# Altium schematic sheet power_on.SchDoc
size A4; SheetNumber: 2; SheetTotal: 2
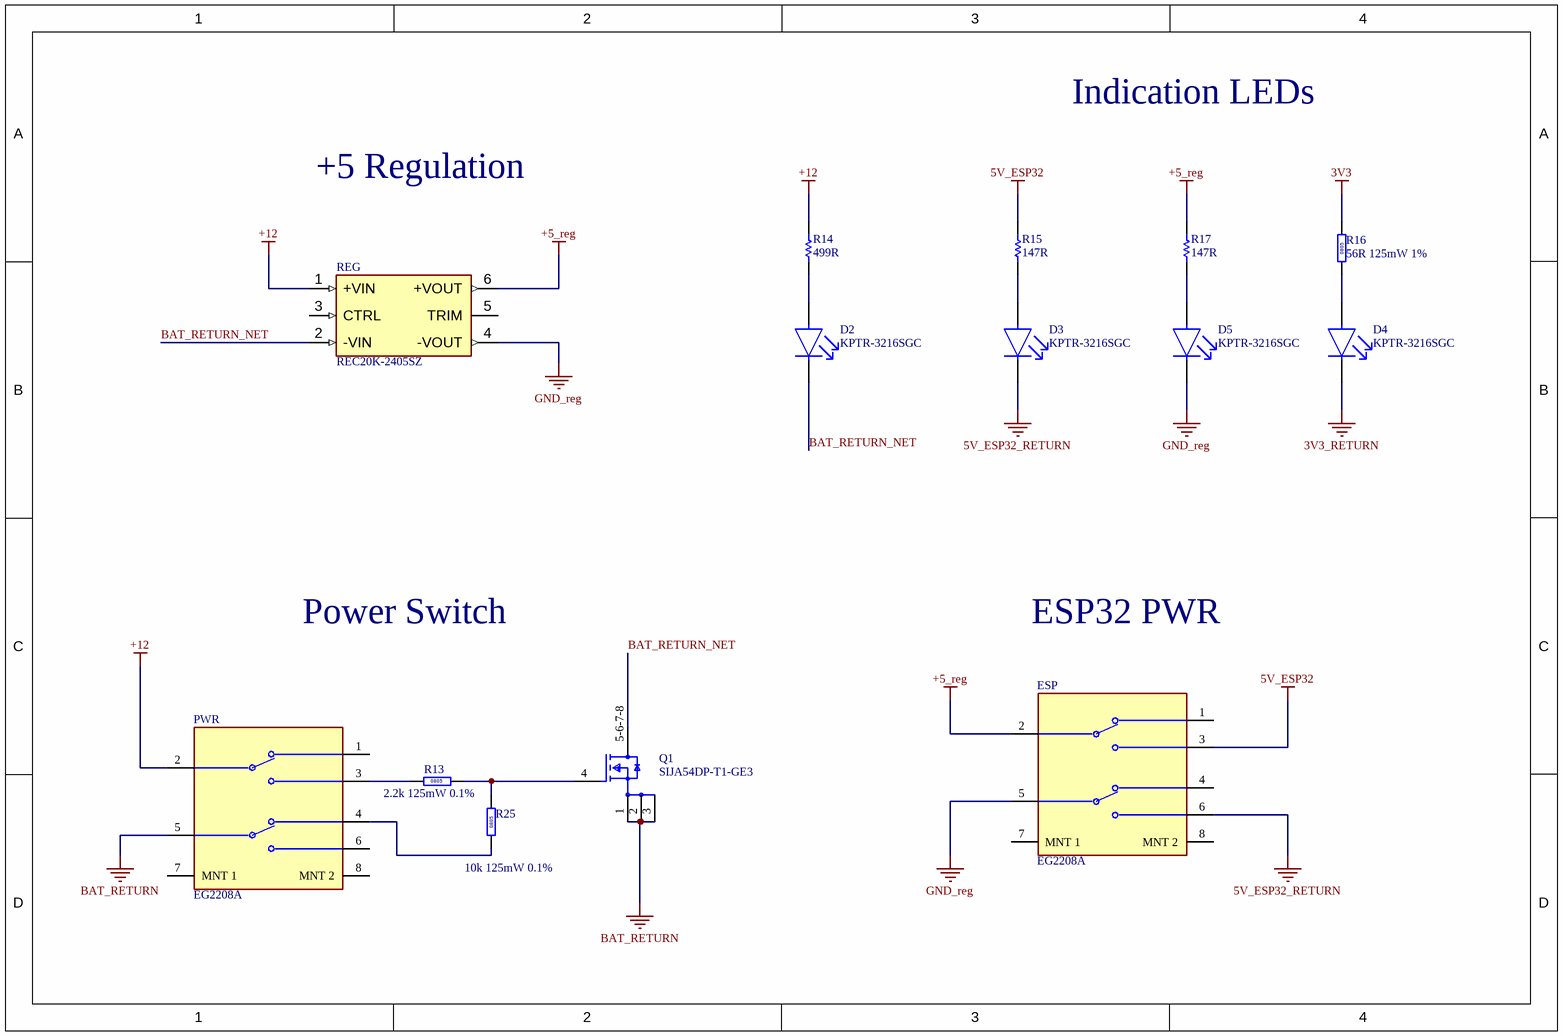
[diagram p0: power_on.SchDoc]

## Parts
D2  KPTR-3216SGC  [KPTR-3216SGC-Footprint-1]
D3  KPTR-3216SGC  [KPTR-3216SGC-Footprint-1]
D4  KPTR-3216SGC  [KPTR-3216SGC-Footprint-1]
D5  KPTR-3216SGC  [KPTR-3216SGC-Footprint-1]
ESP  EG2208A  [FP-EG2208A-MFG]
PWR  EG2208A  [FP-EG2208A-MFG]
Q1  SIJA54DP-T1-GE3  [SIJA54DP-T1-GE3-Footprint-2]
R13  2.2k 125mW 0.1%  [RESC2013X60X35ML10T20]
R14  499R  [RESC2013X60X40ML20T25]
R15  147R  [RESC2013X60X40ML20T25]
R16  56R 125mW 1%  [RESC2013X60X35ML10T20]
R17  147R  [RESC2013X60X40ML20T25]
R25  10k 125mW 0.1%  [RESC2013X60X35ML10T20]
REG  REC20K-2405SZ  [CONV_REC20K-2405SZ]

## Nets
3V3: R16.2
3V3_RETURN: D4.2(C)
5V_ESP32: ESP.3 R15.2
5V_ESP32_RETURN: D3.2(C) ESP.6
+5_reg: ESP.2(Com) R17.2 REG.6(+VOUT)
+12: PWR.2(Com) R14.2 REG.1(+VIN)
BAT_RETURN: PWR.5(Com) Q1.1(S) Q1.2(S) Q1.3(S)
GND_reg: D5.2(C) ESP.5(Com) REG.4(-VOUT)
BAT_RETURN_NET: D2.2(C) Q1.5-6-7-8(D) REG.2(-VIN)
NetD2_1: D2.1(A) R14.1
NetD3_1: D3.1(A) R15.1
NetD4_1: D4.1(A) R16.1
NetD5_1: D5.1(A) R17.1
NetPWR_3: PWR.3 R13.1
NetPWR_4: PWR.4 R25.1
NetQ1_4: Q1.4(G) R13.2 R25.2

Not connected (* = marked no-connect by the designer): ESP 1 4 7(MNT_1) 8(MNT_2); PWR 1 6 7(MNT_1) 8(MNT_2); REG 3(CTRL) 5(TRIM)

## Notes on the sheet
- Indication LEDs
- +5 Regulation
- Power Switch
- ESP32 PWR
- Sheet Title
- Design Title
- Sheet
- SIZE
- A4
- Designer
- PCB Code
- PCB Rev
- Approver
- Assembly Code
- Issue
- EC No.
- Approved Date

## Library data of the parts
D2-D5 = CMP-40-060-00012-7: Single Color LED, Super Bright Green, Water Clear, 1.6mm; Manufacturer: Kingbright; Reverse Voltage-Max: 5V; Overall Height: 1.05mm; Channels: 1; Luminous Intensity-Nom: 15mcd; Forward Voltage: 2.5V; Shape: Rectangular; Luminous Intensity-Min: 120cd; Viewing Angle: 120°; Forward Current: 25mA; ComponentLinkDescription: Datasheet; Terminal Pitch: 3.6mm; Size: 1.6mm; Colour: Super Bright Green; Min Operating Temperature: -40°C; Max Operating Temperature: 85°C; Package: 1206; ComponentLinkURL: https://datasheet.ciiva.com/pdfs/VipMasterIC/IC/KNGB/KNGBS03251/KNGBS03251-1.pdf?src-supplier=IHS+Markit; RoHS Compliant: Yes; Color@wavelength: Green; Maximum Operating Temperature: 85°C; Packaging: Tape and Reel; Minimum Operating Temperature: -40°C; ManufacturerPartNumber: KPTR-3216SGC; Pins: 2; Optoelectronic Device Type: SINGLE COLOR LED; Color: Green; MountingType: SMD; Reach SVHC Compliant: Yes; ForwardVoltage: 2.5V; Lens Style: WATER CLEAR; Mounting Technology: Surface Mount
ESP PWR = CMP-17877-000003-1: SWITCH SLIDE DPDT 200MA 30V; Switch Travel: 2mm; Actuator Type: Standard; Switch Function: On-On; Actuator Length: 6mm; Operating Force: 200gf; Illumination Type: Non-Illuminated; Electrical Life: 10000Cycles; Number of Positions: 2; Contact Current Rating: 200mA; Contact Material: Copper Alloy; Throw Configuration: DPDT; RoHS Compliant: Yes; Lead Free: Lead Free; Termination: PC Pin; Package Quantity: 800; Current Rating: 200mA; REACH SVHC: No SVHC; Max Operating Temperature: 70°C; Min Operating Temperature: -25°C; Contact Plating: Silver; Voltage Rating (DC): 30V; Voltage Rating (AC): 30V; Mount: Through Hole; Orientation: Right Angle; Packaging: Bulk; Series: EG
Q1 = CMP-40-040-00025-2: Transistor, SMD, MOSFET, N-Chan, 40V; Manufacturer: Vishay; ComponentLinkDescription: Datasheet; CurrentRating: 60A; PowerRating: 36.7W; Minimum Operating Temperature: -55°C; Package: PowerPak SO-8; Breakdown Voltage: 40V; RoHS3Compliant: Yes; Maximum Operating Temperature: 150°C; TransistorType: MOSFET, N-Chan; ComponentLinkURL: https://datasheet.ciiva.com/pdfs/VipMasterIC/IC/VISH/VISH-S-A0002290573/VISH-S-A0002281459-1.pdf?src-supplier=IHS+Markit; MountingType: SMD; ManufacturerPartNumber: SIJA54DP-T1-GE3
R13 R25 = CMP-40-025-00231-1: Res, SMD, 100k, 125mW, 0.1%, ±25ppm, 0805; Manufacturer: Panasonic; ManufacturerPartNumber: ERA-6AEB104V; Voltage Rating: 100V; ComponentLinkDescription: Datasheet; Package Height: 0.6; Power Rating: 125mW; Resistor Type: Fixed; RoHS3Certificate: https://download.siliconexpert.com/pdfs2/2024/6/2/9/59/48/925943/pns_/manual/erj6enf2700v_rohs.pdf; Mount: SMD; Case/Package: 0805; Composition: Thin Film; Temperature Coefficient (ppm/cel): ±25ppm; Min Operating Temperature: -55°C; ComponentLinkURL: https://octopart.com/era-6aeb104v-panasonic-1193246; Tolerance: 0.1%; Number of Pins: 2; Reach SVHC Compliant: Unaffected; RoHS3Compliant: Yes (with excemption); Contact Plating: Tin; Max Operating Temperature: 155°C; Resistance: 100k
R14 R15 R17 = CMP-2001-00837-1: Part Number: ERA6AEB4990V; Manufacturer: Panasonic
R16 = CMP-40-025-00232-1: Res, SMD, 56R, 125mW, 1%, ±100ppm, 0805; Manufacturer: Panasonic; ManufacturerPartNumber: ERJ-6ENF56R0V; Voltage Rating: 150V; ComponentLinkDescription: Datasheet; Package Height: 0.6; Resistance: 56; Tolerance: 1%; Composition: Thick Film; ComponentLinkURL: https://octopart.com/erj-6enf56r0v-panasonic-10475342; Resistor Type: Fixed; RoHS3Compliant: Yes (with excemption); Max Operating Temperature: 155°C; Contact Plating: Tin; Power Rating: 125mW; Number of Pins: 2; Case/Package: 0805; Temperature Coefficient (ppm/cel): ±100ppm; Min Operating Temperature: -55°C; RoHS3Certificate: https://download.siliconexpert.com/pdfs2/2024/6/2/9/59/48/925943/pns_/manual/erj6enf2700v_rohs.pdf; Mount: SMD; Reach SVHC Compliant: Unaffected
REG = REC20K-2405SZ: MF: Recom Power; Package: None; Price: None; Value: *; MP: REC20K-2405SZ; Availability: Unavailable